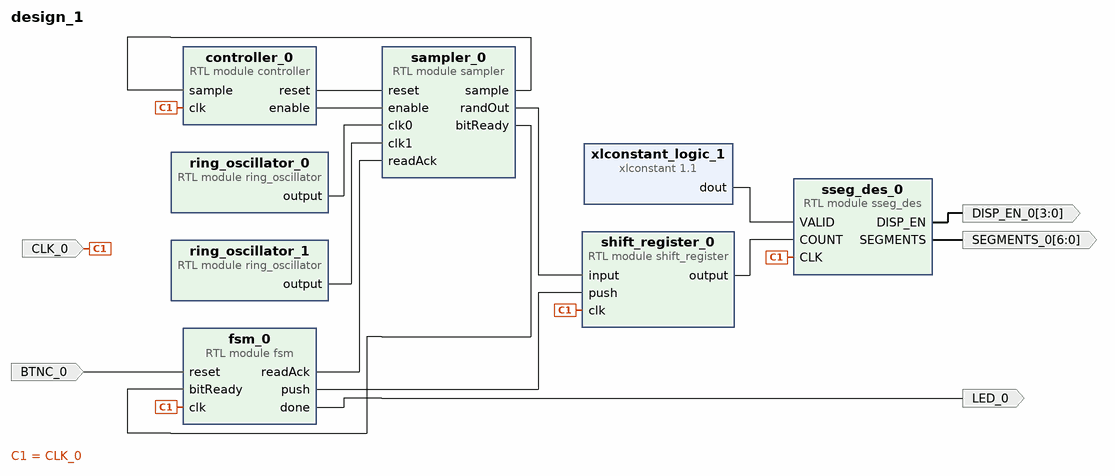
[diagram p0: block diagram of the top level]
# Vivado block design design_1, xc7z020clg400-1, Vivado 2020.2
create_bd_design design_1

create_bd_port -dir I -type clk CLK_0
create_bd_port -dir I BTNC_0
create_bd_port -dir O -from 6 -to 0 SEGMENTS_0
create_bd_port -dir O -from 3 -to 0 DISP_EN_0
create_bd_port -dir O LED_0

create_bd_cell -type module -reference ring_oscillator ring_oscillator_0
create_bd_cell -type module -reference ring_oscillator ring_oscillator_1
create_bd_cell -type module -reference sampler sampler_0
create_bd_cell -type module -reference controller controller_0
create_bd_cell -type module -reference fsm fsm_0
create_bd_cell -type module -reference shift_register shift_register_0
create_bd_cell -type module -reference sseg_des sseg_des_0
create_bd_cell -type ip -vlnv xilinx.com:ip:xlconstant:1.1 xlconstant_logic_1

# ---- connections ----

connect_bd_net [get_bd_pins ring_oscillator_0/output] [get_bd_pins sampler_0/clk0]
connect_bd_net [get_bd_pins ring_oscillator_1/output] [get_bd_pins sampler_0/clk1]
connect_bd_net -net BTNC_0_1 [get_bd_ports BTNC_0] [get_bd_pins fsm_0/reset]
connect_bd_net [get_bd_pins controller_0/reset] [get_bd_pins sampler_0/reset]
connect_bd_net [get_bd_pins fsm_0/done] [get_bd_ports LED_0]
connect_bd_net [get_bd_pins sseg_des_0/DISP_EN] [get_bd_ports DISP_EN_0]
connect_bd_net [get_bd_pins sseg_des_0/SEGMENTS] [get_bd_ports SEGMENTS_0]
connect_bd_net [get_bd_pins sampler_0/sample] [get_bd_pins controller_0/sample]
connect_bd_net [get_bd_pins sampler_0/bitReady] [get_bd_pins fsm_0/bitReady]
connect_bd_net -net CLK_0_1 [get_bd_ports CLK_0] \
  [get_bd_pins fsm_0/clk] [get_bd_pins shift_register_0/clk] [get_bd_pins sseg_des_0/CLK] [get_bd_pins controller_0/clk]
connect_bd_net [get_bd_pins shift_register_0/output] [get_bd_pins sseg_des_0/COUNT]
connect_bd_net -net xlconstant_0_dout [get_bd_pins xlconstant_logic_1/dout] [get_bd_pins sseg_des_0/VALID]
connect_bd_net [get_bd_pins fsm_0/push] [get_bd_pins shift_register_0/push]
connect_bd_net [get_bd_pins sampler_0/randOut] [get_bd_pins shift_register_0/input]
connect_bd_net [get_bd_pins controller_0/enable] [get_bd_pins sampler_0/enable]
connect_bd_net [get_bd_pins fsm_0/readAck] [get_bd_pins sampler_0/readAck]

validate_bd_design
save_bd_design
